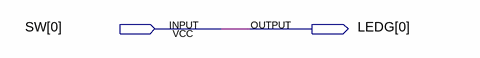
[diagram p0: schematic sheet]
// Quartus schematic ARMvsFPGA.bdf as structural Verilog: 0 symbols, 2 pins
module ARMvsFPGA (
  input  [0:0] SW,
  output [0:0] LEDG
);


  assign LEDG[0] = SW[0];
endmodule
